# EasyEDA schematic SCH_nfc_card_2024-09-17.json
TITLE: Sheet_1; REV: 1.0; Date: 2024-08-14; Sheet: 1/1; Drawn By: souptiksamanta20141188; Company: Your Company
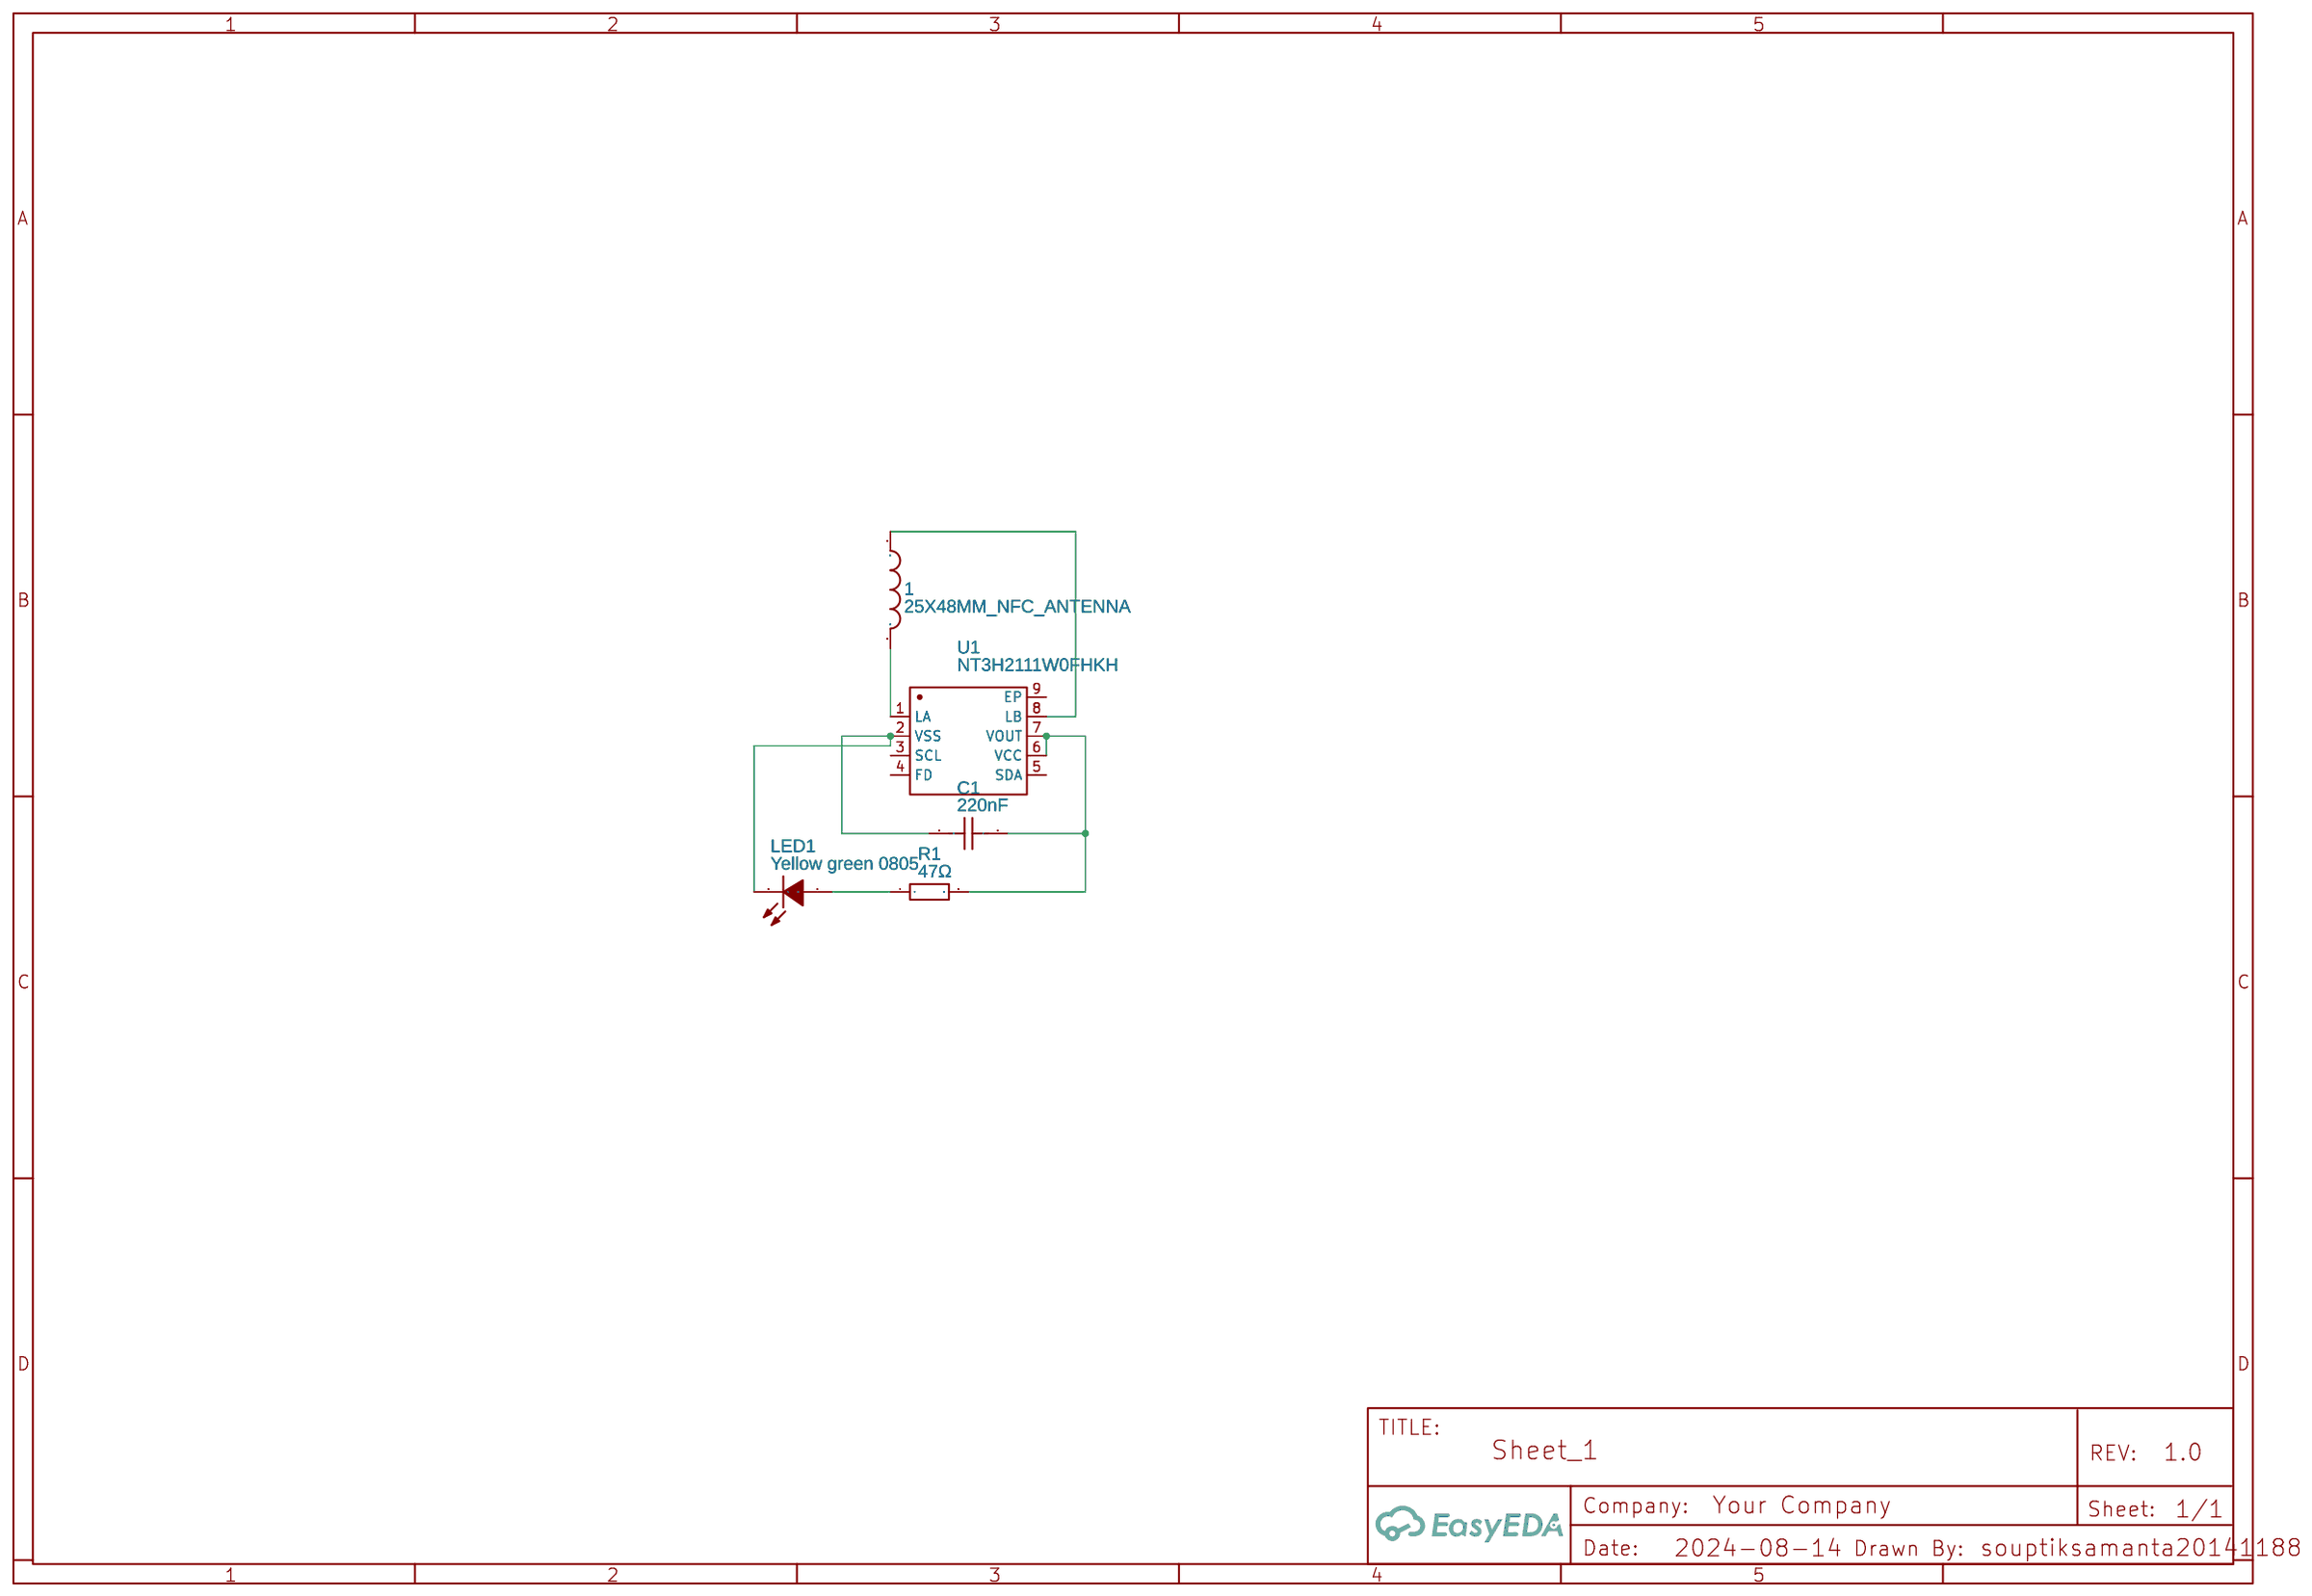
[diagram p0: schematic sheet]

## Parts
1  25X48MM_NFC_ANTENNA  [25X48MM_NFC_ANTENNA]
C1  220nF  [C0805]
LED1  Yellow green 0805  [LED0805-R-RD]
R1  47Ω  [R0603]
U1  NT3H2111W0FHKH  [XQFN-8_L1.6-W1.6-P0.50-BL]

## Library data of the parts
1 = 25X48MM_NFC_ANTENNA: Contributor: Oscar Sortland Kolsrud
C1 = 0805B224K500NT: Contributor: LCSC; Supplier: LCSC; Manufacturer: FH(风华); Supplier Part: C163697; JLCPCB Part Class: Extended Part
LED1 = Yellow green 0805: Supplier: LCSC; Manufacturer: KENTO; Manufacturer Part: KT-0805YG; Supplier Part: C2292; JLCPCB Part Class: Extended Part
R1 = 0603WAF470JT5E: Supplier: LCSC; Manufacturer: UNI-ROYAL(厚声); Supplier Part: C23182; JLCPCB Part Class: Basic Part
U1 = NT3H2111W0FHKH: Contributor: LCSC; Supplier: LCSC; Supplier Part: C710403; Manufacturer: NXP(恩智浦); JLCPCB Part Class: Extended Part

## Nets
Net-(1-P$1): 1.P$1 U1.8(LB)
Net-(1-P$2): 1.P$2 U1.1(LA)
Net-(C1-1): C1.1 R1.2 U1.6(VCC) U1.7(VOUT)
Net-(C1-2): C1.2 LED1.2(K) U1.2(VSS)
Net-(LED1-1): LED1.1(A) R1.1

Not connected (* = marked no-connect by the designer): U1 3(SCL) 4(FD) 5(SDA) 9(EP)
